# EAGLE design MS20vcf (EAGLE 8.3.0)
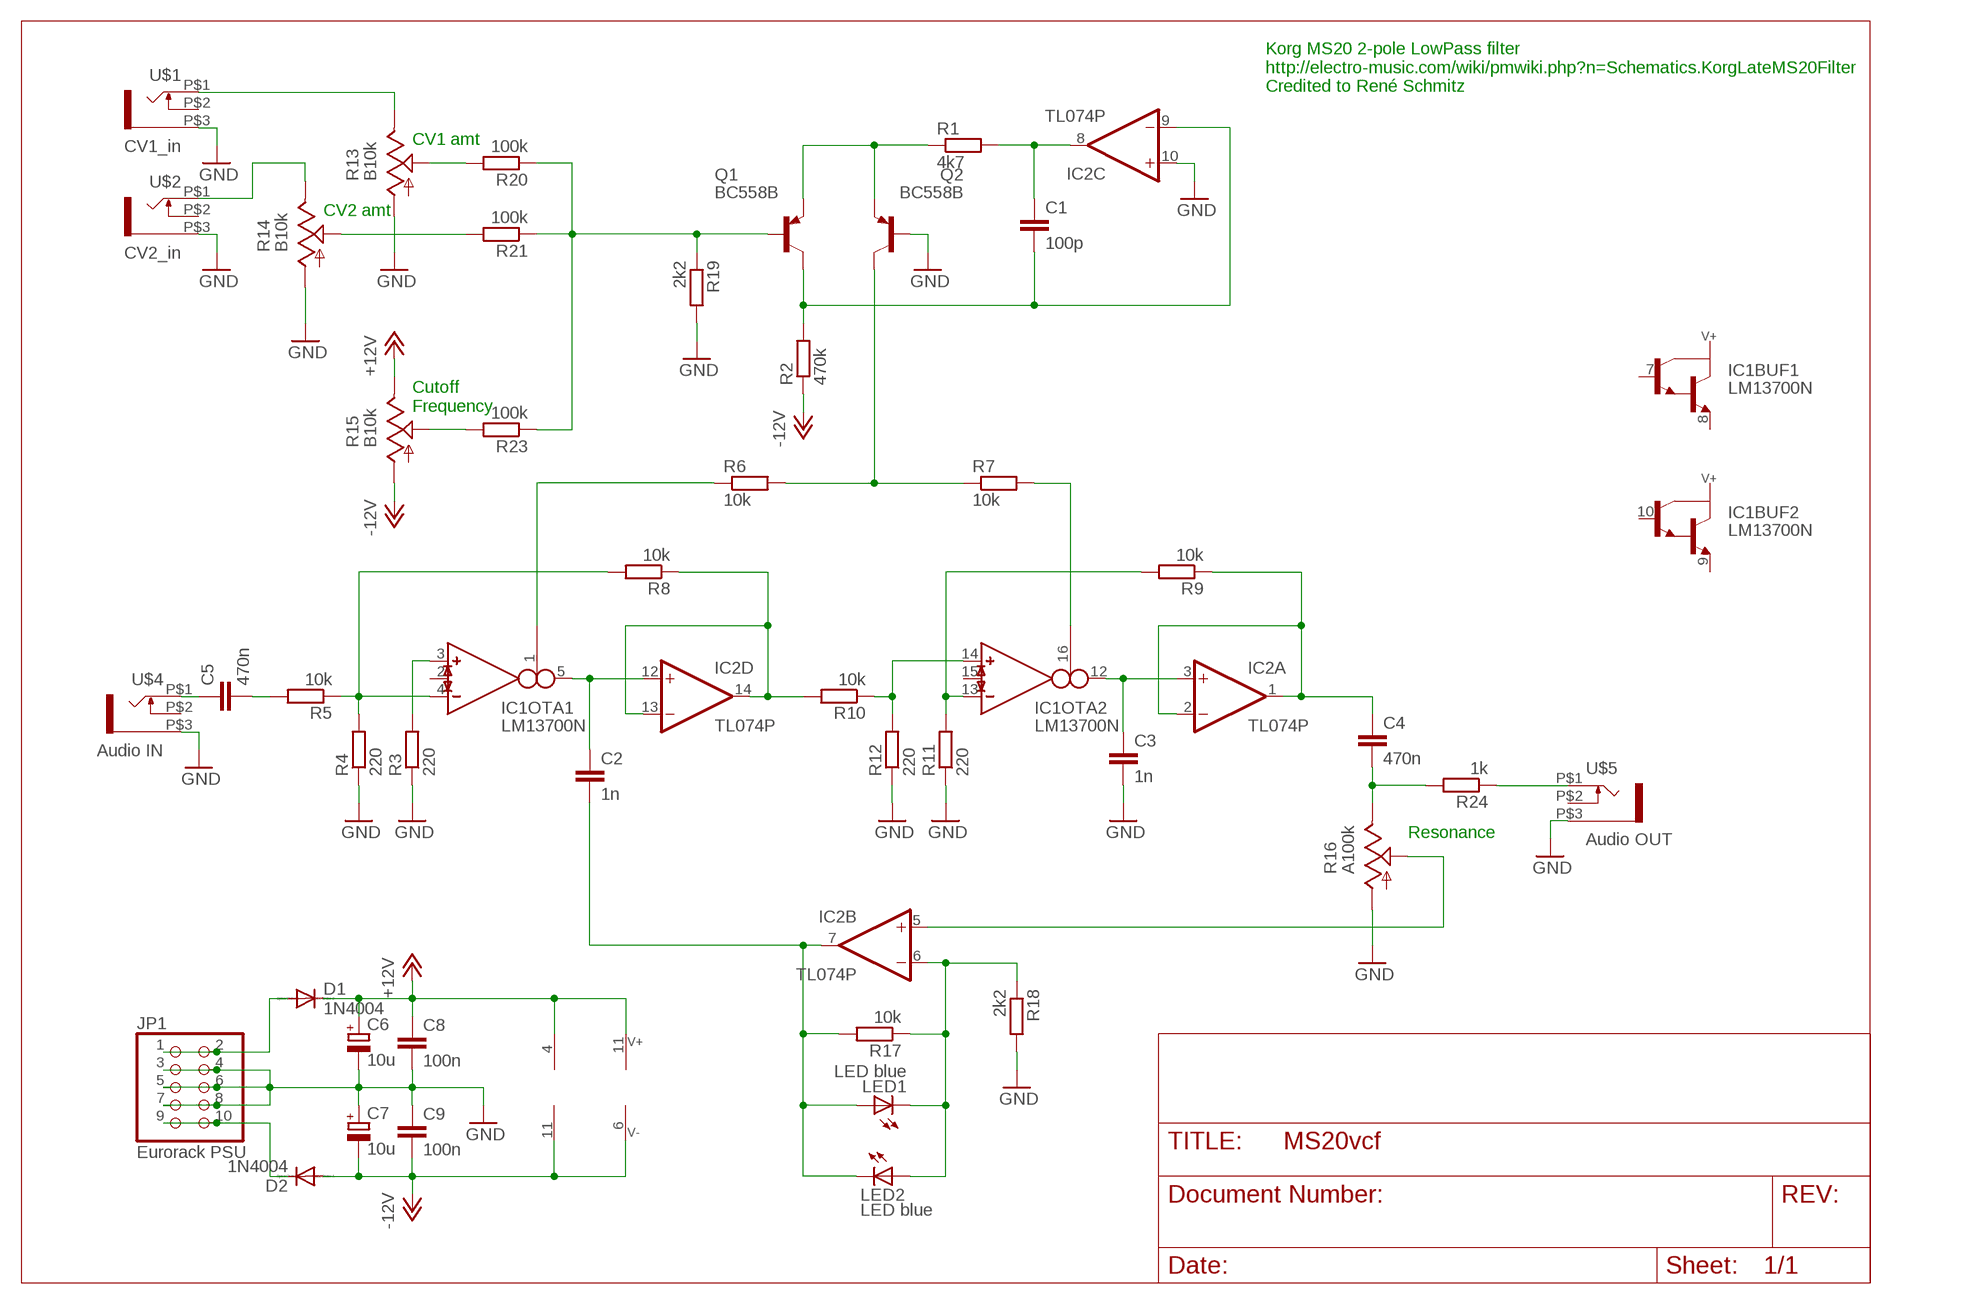
[diagram p0: schematic, sheet 1]

## Parts
C1  100p  C-EU025-025X050  [C025-025X050]
C2  1n  C-EU050-025X075  [C050-025X075]
C3  1n  C-EU050-025X075  [C050-025X075]
C4  470n  C-EU050-025X075  [C050-025X075]
C5  470n  C-EU050-025X075  [C050-025X075]
C6  10u  CPOL-EUE2.5-5  [E2,5-5]
C7  10u  CPOL-EUE2.5-5  [E2,5-5]
C8  100n  C-EU025-025X050  [C025-025X050]
C9  100n  C-EU025-025X050  [C025-025X050]
D1  1N4004  DIODE-D-7.5  [D-7.5]
D2  1N4004  DIODE-D-7.5  [D-7.5]
IC1  LM13700N  [DIL16]
IC2  TL074P  [DIL14]
JP1  Eurorack PSU  PINHD-2X5  [2X05]
LED1  LED blue  LED3MM  [LED3MM]
LED2  LED blue  LED3MM  [LED3MM]
Q1  BC558B  BC558C  [TO92-EBC]
Q2  BC558B  BC558C  [TO92-EBC]
R1  4k7  R-EU_0207/2V  [0207/2V]
R2  470k  R-EU_0207/2V  [0207/2V]
R3  220  R-EU_0207/2V  [0207/2V]
R4  220  R-EU_0207/2V  [0207/2V]
R5  10k  R-EU_0207/2V  [0207/2V]
R6  10k  R-EU_0207/2V  [0207/2V]
R7  10k  R-EU_0207/2V  [0207/2V]
R8  10k  R-EU_0207/2V  [0207/2V]
R9  10k  R-EU_0207/2V  [0207/2V]
R10  10k  R-EU_0207/2V  [0207/2V]
R11  220  R-EU_0207/2V  [0207/2V]
R12  220  R-EU_0207/2V  [0207/2V]
R13  B10k  POT_USVERTICAL  [ALPS_POT_VERTICAL]
R14  B10k  POT_USVERTICAL  [ALPS_POT_VERTICAL]
R15  B10k  POT_USVERTICAL  [ALPS_POT_VERTICAL]
R16  A100k  POT_USVERTICAL  [ALPS_POT_VERTICAL]
R17  10k  R-EU_0207/2V  [0207/2V]
R18  2k2  R-EU_0207/2V  [0207/2V]
R19  2k2  R-EU_0207/2V  [0207/2V]
R20  100k  R-EU_0207/2V  [0207/2V]
R21  100k  R-EU_0207/2V  [0207/2V]
R23  100k  R-EU_0207/2V  [0207/2V]
R24  1k  R-EU_0207/2V  [0207/2V]
U$1  CV1_in  WQP-PJ301M-12_JACK  [WQP-PJ301M-12_JACK]
U$2  CV2_in  WQP-PJ301M-12_JACK  [WQP-PJ301M-12_JACK]
U$4  Audio IN  WQP-PJ301M-12_JACK  [WQP-PJ301M-12_JACK]
U$5  Audio OUT  WQP-PJ301M-12_JACK  [WQP-PJ301M-12_JACK]

## Nets
+12V: C6.+ C8.1 D1.C IC1.11(SUPPLY:V+) IC2.4(P:V+) R15.P$1(E)
-12V: C7.- C9.2 D2.A IC1.6(SUPPLY:V-) IC2.11(P:V-) R2.1 R15.P$3(A)
GND: C3.2 C6.- C7.+ C8.2 C9.1 IC2.10(C:+IN) JP1.3 JP1.4 JP1.5 JP1.6 JP1.7 JP1.8 Q2.B R3.1 R4.1 R11.1 R12.1 R13.P$3(A) R14.P$3(A) R16.P$3(A) R18.2 R19.2 U$1.P$3 U$2.P$3 U$4.P$3 U$5.P$3
N$1: C1.1 IC2.8(C:OUT) R1.2
N$2: Q1.E Q2.E R1.1
N$3: C1.2 IC2.9(C:-IN) Q1.C R2.2
N$4: Q2.C R6.2 R7.1
N$5: IC1.1(OTA1:I_BIAS) R6.1
N$6: IC1.16(OTA2:I_BIAS) R7.2
N$7: C2.1 IC1.5(OTA1:OUT) IC2.12(D:+IN)
N$8: C3.1 IC1.12(OTA2:OUT) IC2.3(A:+IN)
N$9: IC1.13(OTA2:IN_N) R9.2 R11.2
N$10: IC1.3(OTA1:IN_P) R3.2
N$11: IC1.4(OTA1:IN_N) R4.2 R5.1 R8.2
N$12: IC2.13(D:-IN) IC2.14(D:OUT) R8.1 R10.2
N$13: IC1.14(OTA2:IN_P) R10.1 R12.2
N$14: IC2.6(B:-IN) LED1.K(C) LED2.A R17.1 R18.1
N$15: C4.1 IC2.1(A:OUT) IC2.2(A:-IN) R9.1
N$16: C5.2 R5.2
N$17: C4.2 R16.P$1(E) R24.2
N$18: IC2.5(B:+IN) R16.P$2(S)
N$19: C2.2 IC2.7(B:OUT) LED1.A LED2.K(C) R17.2
N$20: Q1.B R19.1 R20.1 R21.1 R23.1
N$21: R15.P$2(S) R23.2
N$23: R13.P$1(E) U$1.P$1
N$24: R14.P$2(S) R21.2
N$25: R13.P$2(S) R20.2
N$26: R14.P$1(E) U$2.P$1
N$27: C5.1 U$4.P$1
N$28: R24.1 U$5.P$1
N$29: D1.A JP1.1 JP1.2
N$31: D2.C JP1.9 JP1.10
Unconnected: IC1.2(OTA1:I_DIODE) IC1.7(BUF1:B) IC1.8(BUF1:E) IC1.9(BUF2:E) IC1.10(BUF2:B) IC1.15(OTA2:I_DIODE) U$1.P$2 U$2.P$2 U$4.P$2 U$5.P$2

## Notes on the sheet
- Korg MS20 2-pole LowPass filter
  http://electro-music.com/wiki/pmwiki.php?n=Schematics.KorgLateMS20Filter
  Credited to René Schmitz
- CV1 amt
- CV2 amt
- Cutoff
  Frequency
- Resonance

## Library data of the parts
C1-C5 C8 C9 = rcl:C-EU: CAPACITOR, European symbol
C6 C7 = rcl:CPOL-EU: POLARIZED CAPACITOR, European symbol
D1 D2 = diode:DIODE-: DIODE
IC1 = ota:LM13700: Dual OTA with buffers
IC2 = linear:TL074: OP AMP
JP1 = pinhead:PINHD-2X5: PIN HEADER
LED1 LED2 = led:LED: LED OSRAM: - CHIPLED LG R971, LG N971, LY N971, LG Q971, LY Q971, LO R971, LY R971 LH N974, LH R974 LS Q976, LO Q976, LY Q976 LO Q996 - Hyper CHIPLED LW Q18S LB Q993, LB Q99A, LB R99A - SideLED LS A670, LO A670, LY A670, LG A670, LP A670 LB A673, LV A673, LT A673, LW A673 LH A674 LY A675 LS A676, LA A676, LO A676, LY A676, LW A676 LS A679, LY A679, LG A679 - Hyper Micro SIDELED® LS Y876, LA Y876, LO Y876, LY Y876 LT Y87S - SmartLED LW L88C, LW L88S LB L89C, LB L89S, LG L890 LS L89K, LO L89K, LY L89K LS L896, LA L896, LO L896, LY L896 - TOPLED LS T670, LO T670, LY T670, LG T670, LP T670 LSG T670, LSP T670, LSY T670, LOP T670, LYG T670 LG T671, LOG T671, LSG T671 LB T673, LV T673, LT T673, LW T673 LH T674 LS T676, LA T676, LO T676, LY T676, LB T676, LH T676, LSB T676, LW T676 LB T67C, LV T67C, LT T67C, LS T67K, LO T67K, LY T67K, LW E67C LS E67B, LA E67B, LO E67B, LY E67B, LB E67C, LV E67C, LT E67C LW T67C LS T679, LY T679, LG T679 LS T770, LO T770, LY T770, LG T770, LP T770 LB T773, LV T773, LT T773, LW T773 LH T774 LS E675, LA E675, LY E675, LS T675 LS T776, LA T776, LO T776, LY T776, LB T776 LHGB T686 LT T68C, LB T68C - Hyper Mini TOPLED® LB M676 - Mini TOPLED Santana® LG M470 LS M47K, LO M47K, LY M47K Source: http://www.osram.convergy.de LUXEON: - LUMILED® LXK2-PW12-R00, LXK2-PW12-S00, LXK2-PW14-U00, LXK2-PW14-V00 LXK2-PM12-R00, LXK2-PM12-S00, LXK2-PM14-U00 LXK2-PE12-Q00, LXK2-PE12-R00, LXK2-PE12-S00, LXK2-PE14-T00, LXK2-PE14-U00 LXK2-PB12-K00, LXK2-PB12-L00, LXK2-PB12-M00, LXK2-PB14-N00, LXK2-PB14-P00, LXK2-PB14-Q00 LXK2-PR12-L00, LXK2-PR12-M00, LXK2-PR14-Q00, LXK2-PR14-R00 LXK2-PD12-Q00, LXK2-PD12-R00, LXK2-PD12-S00 LXK2-PH12-R00, LXK2-PH12-S00 LXK2-PL12-P00, LXK2-PL12-Q00, LXK2-PL12-R00 Source: www.luxeon.com KINGBRIGHT: KA-3528ASYC Source: www.kingbright.com
Q1 Q2 = transistor-pnp:BC558*: PNP Transistror
R1-R12 R17-R21 R23 R24 = rcl:R-EU_: RESISTOR, European symbol
R13-R16 = pot-alps:POT_US
U$1 U$2 U$4 U$5 = thonkiconn:WQP-PJ301M-12_JACK

## Board
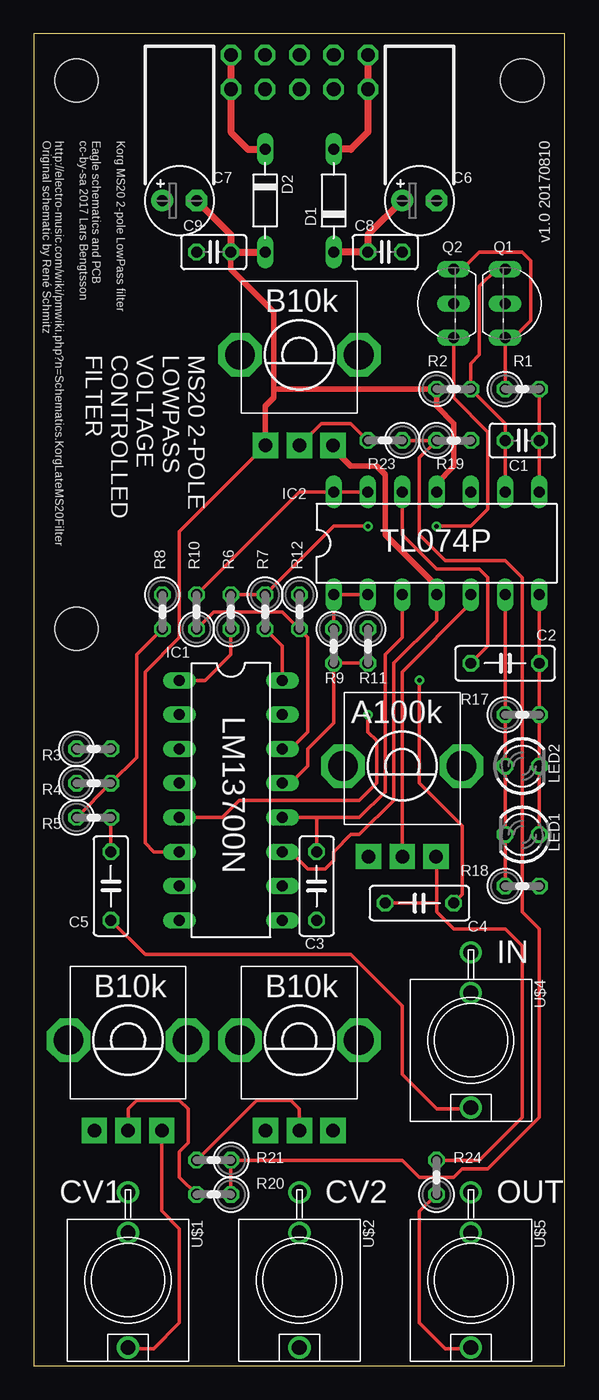
[diagram p1: board, top side]
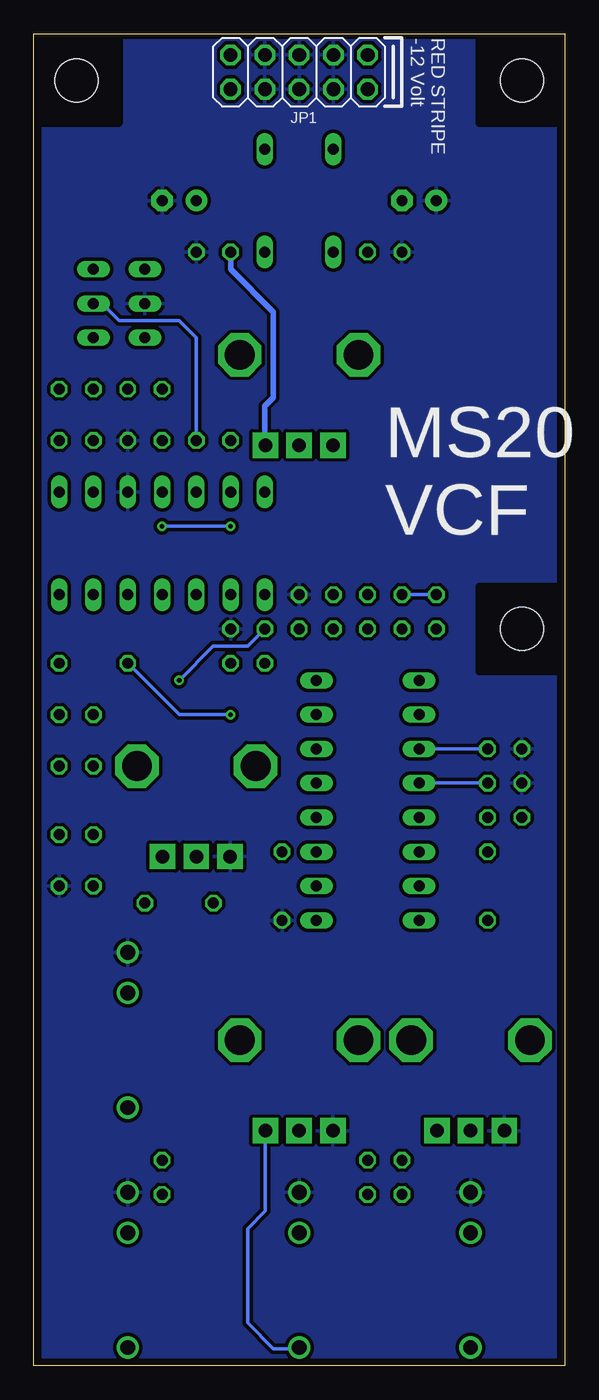
[diagram p2: board, bottom side, seen from below]

Size 39.35 x 98.73 mm. Coordinates in mm from the lower left corner, seen from the top.
Outline: 0,0 39.35,0 39.35,98.73 0,98.73 0,0
Copper layers (1*16): Top 0.0356mm / dielectric 1.5011mm / Bottom 0.0356mm
Design rules "Laen OSH Park PCBOrder": minimum track width 6mil, minimum drill 13mil, track to track 6mil, track to pad 6mil, pad to pad 6mil, via to via 6mil, smd to smd 6mil, copper to edge 15mil, drill to drill 6mil, minimum pad ring 7mil, minimum via ring 7mil, stop-mask expansion 3mil, vias tented up to drill 0mil, thermal gap 10mil
Holes 3.2 mm at 3.17,95.25 36.2,95.25 3.17,54.61
bRestrict: area 0,92.1 to 6.4,98.4; area 33,92.1 to 39.4,98.4; area 0,51.4 to 6.4,57.8

### Footprints (pad centres in the part's own frame; a part is rotated, then mirrored left to right if it is on the bottom)
C025-025X050 = drill 0.813 octagon: 1 -1.27,0; 2 1.27,0
C050-025X075 = drill 0.813 octagon: 1 -2.54,0; 2 2.54,0
E2,5-5 = drill 0.813 pad 1.6: + -1.27,0 | drill 0.813 pad 1.6 octagon: - 1.27,0
D-7.5 = drill 0.813 long: A 3.81,0; C -3.81,0
DIL16 = drill 0.813 long: 1 -8.89,-3.81; 2 -6.35,-3.81; 3 -3.81,-3.81; 4 -1.27,-3.81; 5 1.27,-3.81; 6 3.81,-3.81; 7 6.35,-3.81; 8 8.89,-3.81; 9 8.89,3.81; 10 6.35,3.81; 11 3.81,3.81; 12 1.27,3.81; 13 -1.27,3.81; 14 -3.81,3.81; 15 -6.35,3.81; 16 -8.89,3.81
DIL14 = drill 0.813 long: 1 -7.62,-3.81; 2 -5.08,-3.81; 3 -2.54,-3.81; 4 0,-3.81; 5 2.54,-3.81; 6 5.08,-3.81; 7 7.62,-3.81; 8 7.62,3.81; 9 5.08,3.81; 10 2.54,3.81; 11 0,3.81; 12 -2.54,3.81; 13 -5.08,3.81; 14 -7.62,3.81
2X05 = drill 1.016 octagon: 1 -5.08,-1.27; 2 -5.08,1.27; 3 -2.54,-1.27; 4 -2.54,1.27; 5 0,-1.27; 6 0,1.27; 7 2.54,-1.27; 8 2.54,1.27; 9 5.08,-1.27; 10 5.08,1.27
LED3MM = drill 0.813 octagon: A -1.27,0; K 1.27,0
TO92-EBC = drill 0.813 long: B 0,-1.27; C -2.54,-1.27; E 2.54,-1.27
0207/2V = drill 0.813 octagon: 1 -1.27,0; 2 1.27,0
ALPS_POT_VERTICAL = drill 1 pad 1.88 square: P$1 -2.5,6.7; P$2 0,6.7; P$3 2.5,6.7 | drill 2.2 pad 3.175 octagon: P$4 -4.4,0; P$5 4.4,0
WQP-PJ301M-12_JACK = drill 1.1: P$1 0,5; P$2 0,-3.5; P$3 0,-6.5

### Placement (x,y rotation side)
C1  36.2,68.58 180 top
C2  34.93,52.07 0 top
C3  20.95,35.56 270 top
C4  28.57,34.29 180 top
C5  5.71,35.56 90 top
C6  28.57,86.36 0 top
C7  10.79,86.36 0 top
C8  26.04,82.55 0 top
C9  13.34,82.55 0 top
D1  22.22,86.36 90 top
D2  17.14,86.36 270 top
IC1  14.61,41.91 270 top
IC2  29.84,60.96 0 top
JP1  19.68,95.89 0 bottom
LED1  36.2,39.37 180 top
LED2  36.2,44.45 0 top
Q1  36.2,78.74 270 top
Q2  29.84,78.74 90 top
R1  36.2,72.39 0 top
R2  31.11,72.39 0 top
R3  4.45,45.72 0 top
R4  4.45,43.18 0 top
R5  4.45,40.64 0 top
R6  14.61,55.88 90 top
R7  17.14,55.88 270 top
R8  9.53,55.88 270 top
R9  22.22,53.34 270 top
R10  12.06,55.88 90 top
R11  24.76,53.34 270 top
R12  19.68,55.88 270 top
R13  6.99,24.13 180 top
R14  19.68,24.13 180 top
R15  19.68,74.93 180 top
R16  27.3,44.45 180 top
R17  36.2,48.26 0 top
R18  36.2,35.56 0 top
R19  31.11,68.58 0 top
R20  13.34,12.7 180 top
R21  13.34,15.24 180 top
R23  26.04,68.58 180 top
R24  29.84,13.97 90 top
U$1  6.99,6.35 180 top
U$2  19.68,6.35 180 top
U$4  32.39,24.13 180 top
U$5  32.39,6.35 180 top

### Tracks (layer width: path | path; a pad name or v marks a point on that pad's centre or on a via)
+12V
  Top 0.254: IC2.4 29.84,55.24 26.67,52.07 26.67,41.91 24.13,39.37 23.49,39.37 22.22,38.1 22.22,37.46 21.59,36.83 20.32,36.83 19.05,38.1 IC1.11
  Top 0.406: R15.P$1 22.18,67.98 23.49,66.67 25.4,66.67 26.04,66.04 26.04,61.59 29.84,57.78 IC2.4
  Top 0.508: D1.C C8.1 24.76,83.82 C6.+
  Bottom 0.406: C8.1 24.76,81.28 21.59,78.11 21.59,71.76 22.22,71.12 22.22,68.27 R15.P$1
-12V
  Top 0.254: IC1.6 8.89,38.1 8.26,38.73 8.26,51.43 10.79,53.97 10.79,61.84 R15.P$3
  Top 0.406: C9.2 14.61,81.28 17.78,78.11 17.78,72.47 | 17.78,72.47 17.78,71.76 17.14,71.12 17.14,68.27 R15.P$3 | IC2.11 29.84,65.41 31.11,66.67 31.11,69.85 29.84,71.12 R2.1 17.86,72.39 17.78,72.47
  Top 0.508: D2.A C9.2 14.61,83.82 C7.-
GND
  pour Bottom (isolate 0.254): 0.64,98.42 38.73,98.42 38.73,0.64 0.64,0.64
N$1
  Top 0.254: IC2.8 C1.1 R1.2
N$2
  Top 0.254: R1.1 Q1.E 35.56,76.2 36.83,77.47 36.83,81.92 36.2,82.55 33.02,82.55 31.75,81.28 Q2.E
N$3
  Top 0.254: IC2.9 C1.2 34.93,69.85 R2.2 32.39,74.3 33.02,74.93 33.02,80.01 34.29,81.28 Q1.C
N$4  (via drill 0.35)
  Top 0.254: R6.2 R7.1 22.22,62.23 v24.76,62.23 | v29.84,62.23 32.39,62.23 33.66,63.5 33.66,69.22 31.11,71.76 Q2.C
  Bottom 0.254: v29.84,62.23 v24.76,62.23
N$5
  Top 0.254: IC1.1 12.7,50.8 14.61,52.7 R6.1
N$6
  Top 0.254: R7.2 18.41,53.34 IC1.16
N$7  (via drill 0.35)
  Top 0.254: IC2.12 27.3,61.59 29.84,59.05 33.02,59.05 33.66,58.42 33.66,53.34 C2.1 | IC1.5 13.97,40.64 15.24,41.91 24.13,41.91 25.4,43.18 25.4,46.35 24.76,46.99 v24.76,48.26
  Bottom 0.254: v24.76,48.26 28.57,48.26 C2.1
N$8
  Top 0.254: IC2.3 27.3,53.97 26.04,52.7 26.04,42.54 24.13,40.64 21.01,40.64 | 21.01,40.64 IC1.12 | C3.1 20.95,40.58 21.01,40.64
N$9
  Top 0.254: R11.2 R9.2 22.22,47.62 20.32,45.72 20.32,44.45 19.05,43.18 IC1.13
N$10
  Bottom 0.254: IC1.3 R3.2
N$11
  Top 0.254: R8.2 7.62,52.7 7.62,45.08 R4.2 R5.1
  Bottom 0.254: R4.2 IC1.4
N$12
  Top 0.254: R10.2 19.68,64.77 IC2.14 IC2.13
  Bottom 0.254: R8.1 R10.2
N$13
  Top 0.254: R10.1 13.34,55.88 18.41,55.88 R12.2 20.32,53.97 20.32,46.99 19.05,45.72 IC1.14
N$14
  Top 0.254: IC2.6 R17.1 LED2.A LED1.K R18.1
N$15  (via drill 0.35)
  Top 0.254: IC2.2 IC2.1 R9.1 | C4.1 31.75,34.92 31.75,40 28.57,43.18 v28.57,50.8
  Bottom 0.254: v28.57,50.8 26.04,53.34 23.49,53.34 R9.1
N$16
  Top 0.254: R5.2 C5.2
N$17
  Top 0.254: R24.2 33.02,15.24 36.2,18.41 36.2,31.11 34.93,32.38 31.11,32.38 29.84,33.65 29.84,34.19 | 29.84,34.19 29.84,37.71 R16.P$1 | C4.2 29.74,34.29 29.84,34.19
N$18
  Top 0.254: R16.P$2 27.3,51.43 32.39,56.51 IC2.5
N$19
  Top 0.254: IC2.7 C2.2 R17.2 LED2.K LED1.A
N$20
  Top 0.254: R23.1 R19.1 28.57,67.31 28.57,61.59 30.48,59.69 34.93,59.69 36.2,58.42 36.2,33.65 37.47,32.38 37.47,18.41 33.66,14.61 31.75,14.61 31.11,13.97 28.57,13.97 27.3,15.24 14.73,15.24 14.61,15.12 | 14.61,15.12 R21.1 | 14.61,15.12 R20.1
  Bottom 0.254: R23.1 27.3,76.2 28.57,77.47 33.02,77.47 34.29,78.74 Q1.B
N$21
  Top 0.254: R23.2 23.49,69.85 21.3,69.85 R15.P$2
N$23
  Top 0.254: R13.P$1 9.48,11.47 10.79,10.16 10.79,3.18 8.89,1.27 7.07,1.27 U$1.P$1
N$24
  Top 0.254: R14.P$2 19.68,19.05 19.05,19.68 16.51,19.68 R21.2
N$25
  Top 0.254: R13.P$2 6.99,19.05 7.62,19.68 10.79,19.68 11.43,19.05 11.43,16.51 10.79,15.88 10.79,13.97 R20.2
N$26
  Bottom 0.254: R14.P$1 22.18,11.47 23.49,10.16 23.49,3.18 21.59,1.27 19.76,1.27 U$2.P$1
N$27
  Top 0.254: C5.1 8.26,30.48 23.49,30.48 27.3,26.67 27.3,21.59 29.84,19.05 32.3,19.05 U$4.P$1
N$28
  Top 0.254: R24.1 28.57,11.43 28.57,3.18 30.48,1.27 32.3,1.27 U$5.P$1
N$29
  Top 0.508: JP1.2 JP1.1 24.76,91.44 23.49,90.17 D1.A
N$31
  Top 0.508: JP1.10 JP1.9 14.61,91.44 15.88,90.17 D2.C

### Text on the board
tPlace: B10k | A100k | IN | B10k | B10k | CV1 | CV2 | OUT
tNames: Korg MS20 2-pole LowPass filter / / Eagle schematics and PCB / cc-by-sa 2017 Lars Bengtsson / / http://electro-music.com/wiki/pmwiki.php?n=Schematics.KorgLateMS20Filter / Original schematic by René Schmitz | v1.0 20170810 | MS20 2-POLE / LOWPASS / VOLTAGE / CONTROLLED / FILTER
bNames: RED STRIPE / -12 Volt | MS20 / VCF